# EAGLE schematic en_v5 (EAGLE 9.6.2)

## Sheet 1 of 7: Header and connector
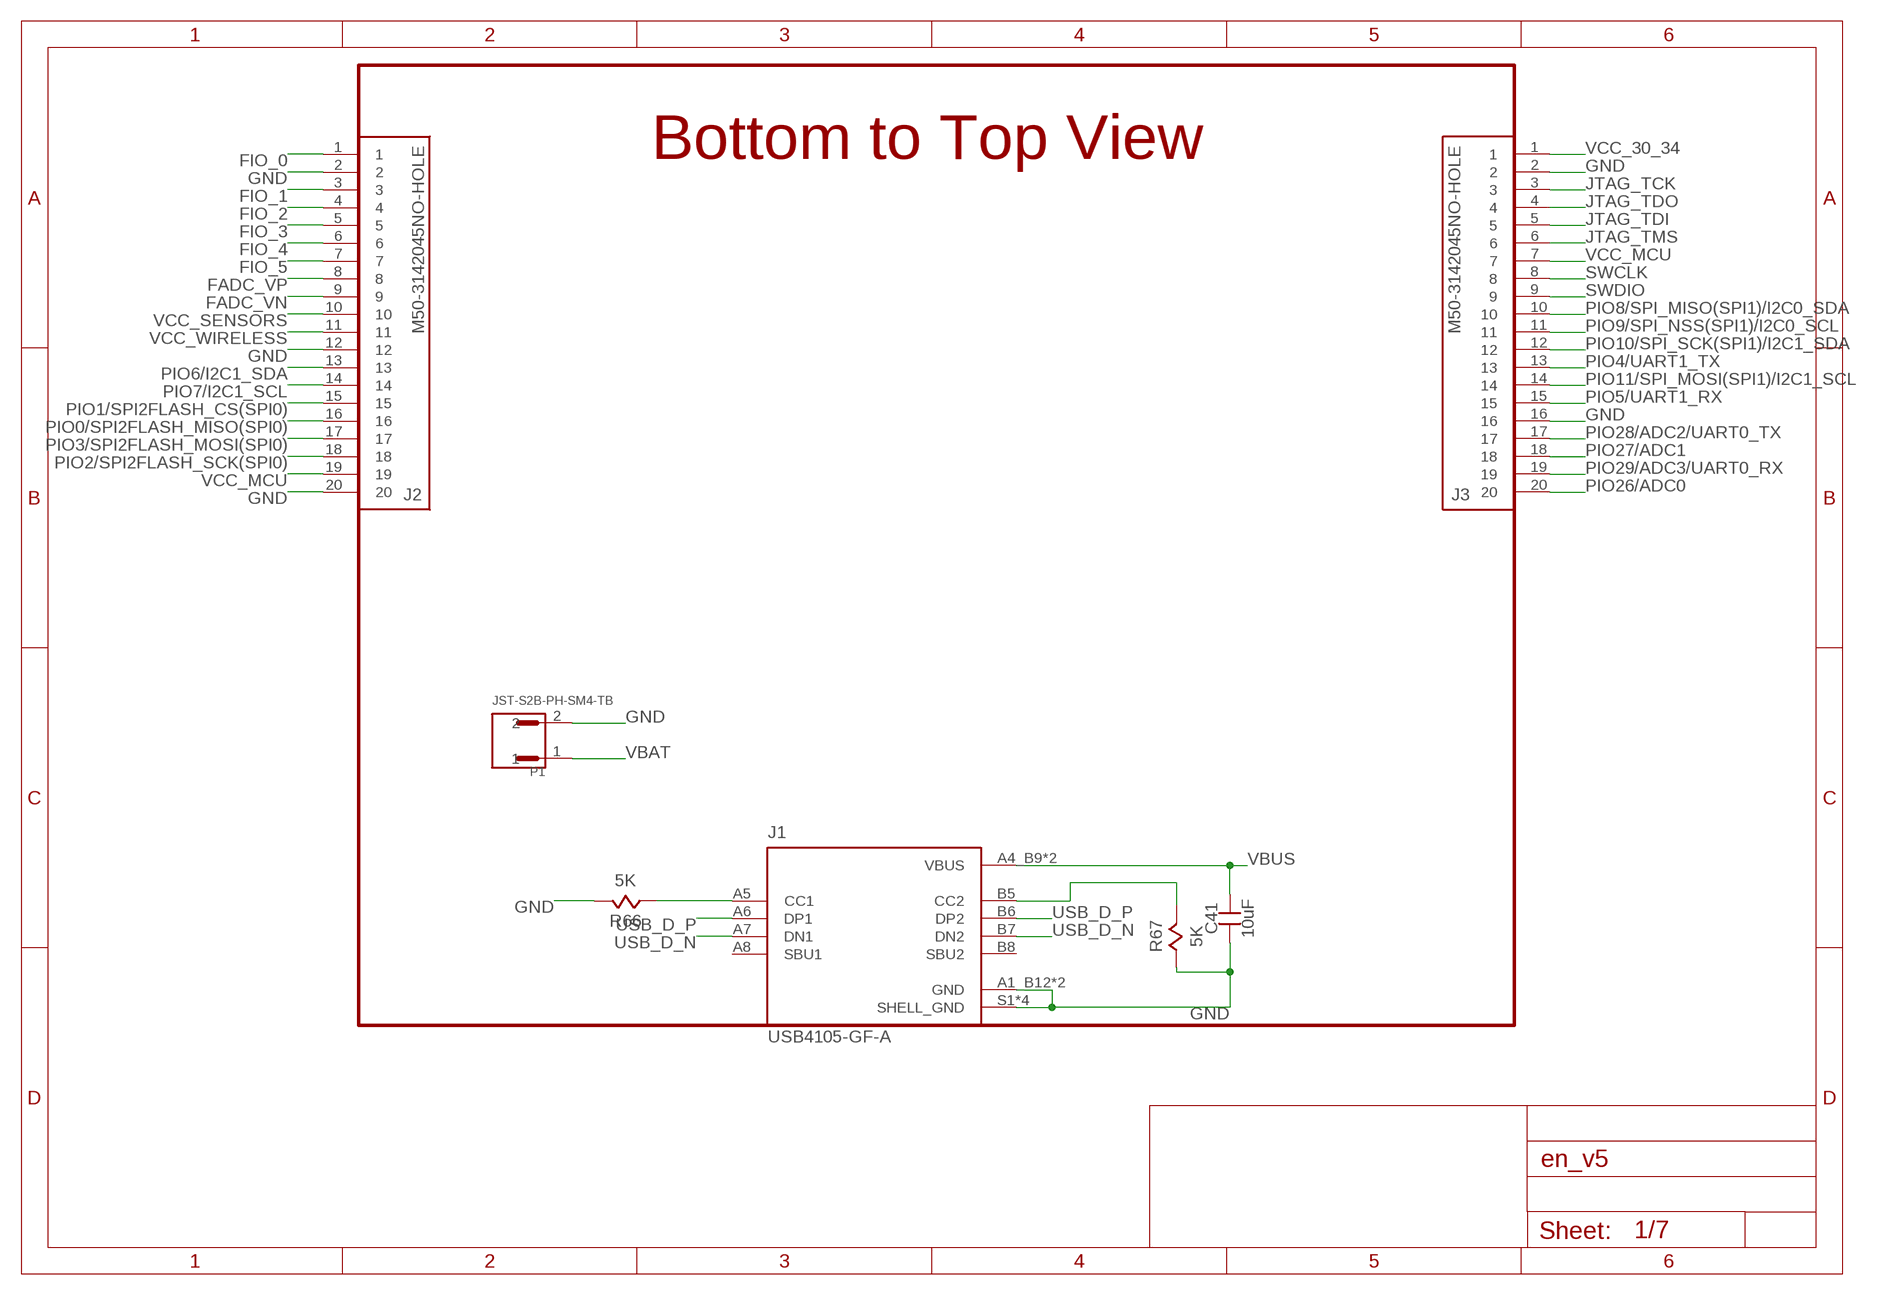
[diagram p0: schematic, sheet 1]

### Parts
C41  10uF  CAPACITOR0805  [0805]
J1  USB4105-GF-A  [GCT_USB4105-GF-A]
J2  M50-3142045NO-HOLE  [M503142045-NO_HOLE]
J3  M50-3142045NO-HOLE  [M503142045-NO_HOLE]
P1  JST-S2B-PH-SM4-TB  [JST_S2B-PH-SM4-TB]
R66  5K  RESISTORSMD_0402  [0402]
R67  5K  RESISTORSMD_0402  [0402]

### Nets
FADC_VN: J2.9 ; also sheet 5
FADC_VP: J2.8 ; also sheet 5
FIO_0: J2.1 ; also sheet 5
FIO_1: J2.3 ; also sheet 5
FIO_2: J2.4 ; also sheet 5
FIO_3: J2.5 ; also sheet 5
FIO_4: J2.6 ; also sheet 5
FIO_5: J2.7 ; also sheet 5
GND: C41.1 J1.A1_B12(GND) J1.B1_A12(GND) J1.S1(SHELL_GND) J1.S2(SHELL_GND) J1.S3(SHELL_GND) J1.S4(SHELL_GND) J2.2 J2.12 J2.20 J3.2 J3.16 P1.2 R66.2 R67.1 ; also sheet 2,3,4,5,6
JTAG_TCK: J3.3 ; also sheet 5
JTAG_TDI: J3.5 ; also sheet 5
JTAG_TDO: J3.4 ; also sheet 5
JTAG_TMS: J3.6 ; also sheet 5
N$19: J1.B5(CC2) R67.2
N$35: J1.A5(CC1) R66.1
PIO0/SPI2FLASH_MISO(SPI0): J2.16 ; also sheet 4,6
PIO1/SPI2FLASH_CS(SPI0): J2.15 ; also sheet 4,5,6
PIO2/SPI2FLASH_SCK(SPI0): J2.18 ; also sheet 4,5,6
PIO3/SPI2FLASH_MOSI(SPI0): J2.17 ; also sheet 4,6
PIO4/UART1_TX: J3.13 ; also sheet 4
PIO5/UART1_RX: J3.15 ; also sheet 4
PIO6/I2C1_SDA: J2.13 ; also sheet 3,4
PIO7/I2C1_SCL: J2.14 ; also sheet 3,4
PIO8/SPI_MISO(SPI1)/I2C0_SDA: J3.10 ; also sheet 4
PIO9/SPI_NSS(SPI1)/I2C0_SCL: J3.11
PIO10/SPI_SCK(SPI1)/I2C1_SDA: J3.12 ; also sheet 4
PIO11/SPI_MOSI(SPI1)/I2C1_SCL: J3.14
PIO26/ADC0: J3.20 ; also sheet 4
PIO27/ADC1: J3.18 ; also sheet 4
PIO28/ADC2/UART0_TX: J3.17 ; also sheet 4
PIO29/ADC3/UART0_RX: J3.19 ; also sheet 4
SWCLK: J3.8 ; also sheet 4
SWDIO: J3.9 ; also sheet 4
USB_D_N [diff pairs]: J1.A7(DN1) J1.B7(DN2) ; also sheet 4
USB_D_P [diff pairs]: J1.A6(DP1) J1.B6(DP2) ; also sheet 4
VBAT: P1.1 ; also sheet 2
VBUS: C41.2 J1.A4_B9(VBUS) J1.B4_A9(VBUS) ; also sheet 2
VCC_30_34: J3.1 ; also sheet 3,5,6
VCC_MCU: J2.19 J3.7 ; also sheet 3,4
VCC_SENSORS: J2.10 ; also sheet 3
VCC_WIRELESS: J2.11 ; also sheet 3
Unconnected: J1.A8(SBU1) J1.B8(SBU2)

### Notes on the sheet
- Bottom to Top View

## Sheet 2 of 7: Power Management
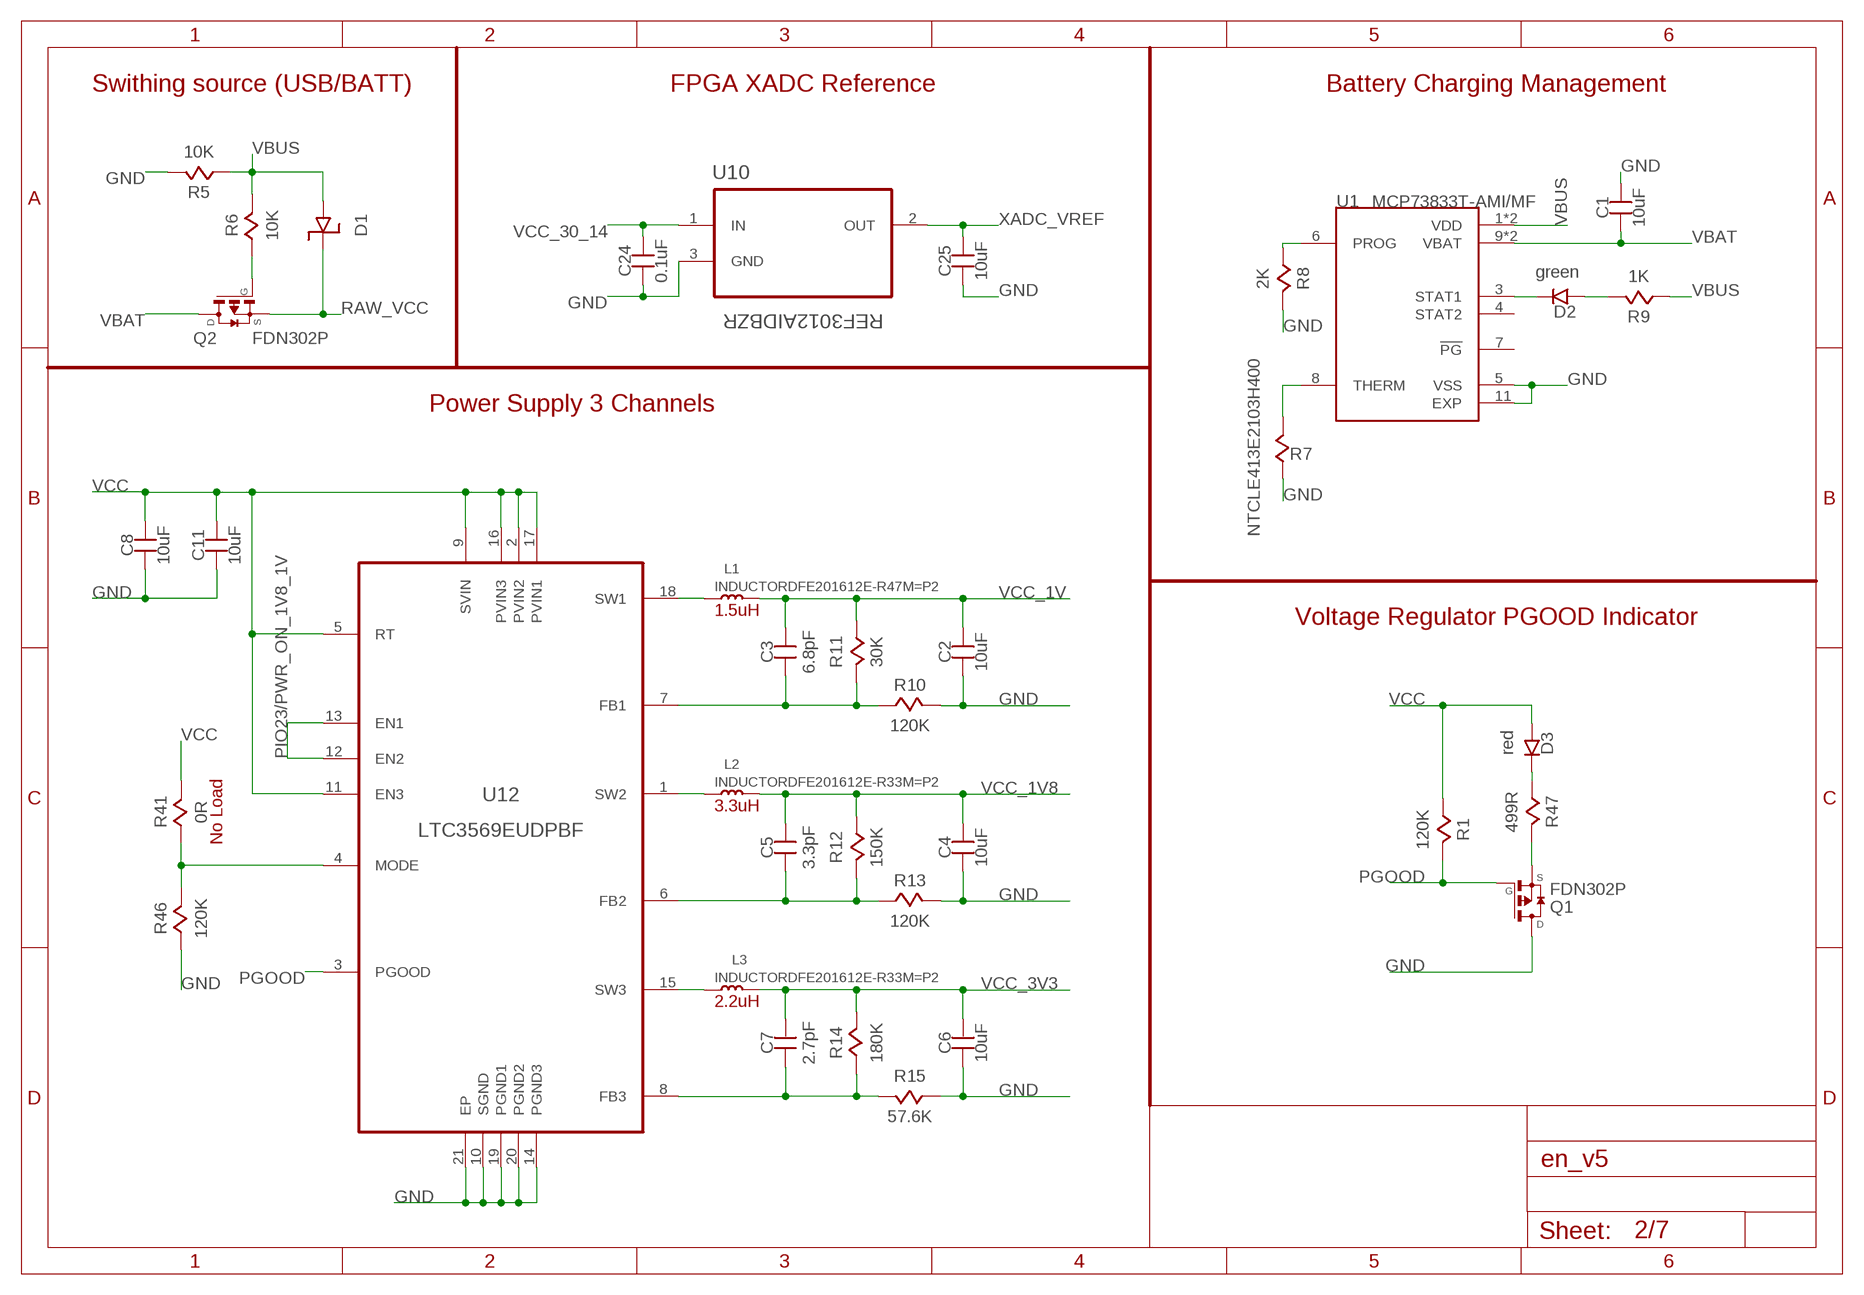
[diagram p1: schematic, sheet 2]

### Parts
C1  10uF  CAPACITOR0805  [0805]
C2  10uF  CAPACITOR0603  [CAPC1608-0603]
C3  6.8pF  CAPACITOR0402  [0402]
C4  10uF  CAPACITOR0603  [CAPC1608-0603]
C5  3.3pF  CAPACITOR0402  [0402]
C6  10uF  CAPACITOR0603  [CAPC1608-0603]
C7  2.7pF  CAPACITOR0402  [0402]
C8  10uF  CAPACITOR0603  [CAPC1608-0603]
C11  10uF  CAPACITOR0603  [CAPC1608-0603]
C24  0.1uF  CAPACITOR0402  [0402]
C25  10uF  CAPACITOR0603  [CAPC1608-0603]
D1  DIODEB5817W  SCHOTTKY_DIODEB5817W  [SOD-123]
D2  green  LED0402  [0402]
D3  red  LED0402  [0402]
L1  INDUCTORDFE201612E-R47M=P2  INDUCTORDFE201612E-R33M=P2  [INDC2016X120N]
L2  INDUCTORDFE201612E-R33M=P2  [INDC2016X120N]
L3  INDUCTORDFE201612E-R33M=P2  [INDC2016X120N]
Q1  FDN302P  [SSOT-3]
Q2  FDN302P  [SSOT-3]
R1  120K  RESISTORSMD_0402  [0402]
R5  10K  RESISTORSMD_0402  [0402]
R6  10K  RESISTORSMD_0402  [0402]
R7  NTCLE413E2103H400  RESISTORTHT_THERMAL  [THT_2]
R8  2K  RESISTORSMD_0402  [0402]
R9  1K  RESISTORSMD_0402  [0402]
R10  120K  RESISTORSMD_0402  [0402]
R11  30K  RESISTORSMD_0402  [0402]
R12  150K  RESISTORSMD_0402  [0402]
R13  120K  RESISTORSMD_0402  [0402]
R14  180K  RESISTORSMD_0402  [0402]
R15  57.6K  RESISTORSMD_0402  [0402]
R41  0R  RESISTORSMD_0402  [0402]
R46  120K  RESISTORSMD_0402  [0402]
R47  499R  RESISTORSMD_0402  [0402]
U1  MCP73833T-AMI/MF  [DFN-10(3X3X0.9)]
U10  REF3012AIDBZR  [SOT-23(3PIN)]
U12  LTC3569EUDPBF  [QFN40P300X300X80-21N]

### Nets
GND: C1.2 C2.1 C4.2 C6.2 C8.2 C11.2 C24.1 C25.1 Q1.3(D) R5.2 R7.P$1 R8.2 R10.2 R13.2 R15.2 R46.1 U1.5(VSS) U1.11(EXP) U10.3(GND) U12.10(SGND) U12.14(PGND3) U12.19(PGND1) U12.20(PGND2) U12.21(EP) ; also sheet 1,3,4,5,6
N$1: R7.P$2 U1.8(THERM)
N$2: R8.1 U1.6(PROG)
N$3: Q2.1(G) R6.1
N$4: L2.1 U12.1(SW2)
N$5: L1.1 U12.18(SW1)
N$6: D2.2 U1.3(STAT1)
N$7: D2.1 R9.2
N$8: C3.2 R10.1 R11.2 U12.7(FB1)
N$9: L3.2 U12.15(SW3)
N$11: C7.2 R14.2 R15.1 U12.8(FB3)
N$12: C5.2 R12.2 R13.1 U12.6(FB2)
N$13: Q1.2(S) R47.2
N$22: D3.2 R47.1
N$23: R41.1 R46.2 U12.4(MODE)
PGOOD: Q1.1(G) R1.2 U12.3(PGOOD)
PIO23/PWR_ON_1V8_1V: U12.12(EN2) U12.13(EN1) ; also sheet 4
RAW_VCC: D1.1(C) Q2.2(S) ; also sheet 3
VBAT: C1.1 Q2.3(D) U1.9(VBAT) U1.10(VBAT) ; also sheet 1
VBUS: D1.2(A) R5.1 R6.2 R9.1 U1.1(VDD) U1.2(VDD) ; also sheet 1
VCC: C8.1 C11.1 D3.1 R1.1 R41.2 U12.2(PVIN2) U12.5(RT) U12.9(SVIN) U12.11(EN3) U12.16(PVIN3) U12.17(PVIN1) ; also sheet 3
VCC_1V: C2.2 C3.1 L1.2 R11.1 ; also sheet 3
VCC_1V8: C4.1 C5.1 L2.2 R12.1 ; also sheet 3
VCC_3V3: C6.1 C7.1 L3.1 R14.1 ; also sheet 3
VCC_30_14: C24.2 U10.1(IN) ; also sheet 3,5,6
XADC_VREF: C25.2 U10.2(OUT) ; also sheet 5
Unconnected: U1.4(STAT2) U1.7(!PG)

### Notes on the sheet
- Swithing source (USB/BATT) | FPGA XADC Reference | Battery Charging Management
- Power Supply 3 Channels
- 1.5uH | Voltage Regulator PGOOD Indicator
- No Load | 3.3uH
- 2.2uH

## Sheet 3 of 7: Power Monitor
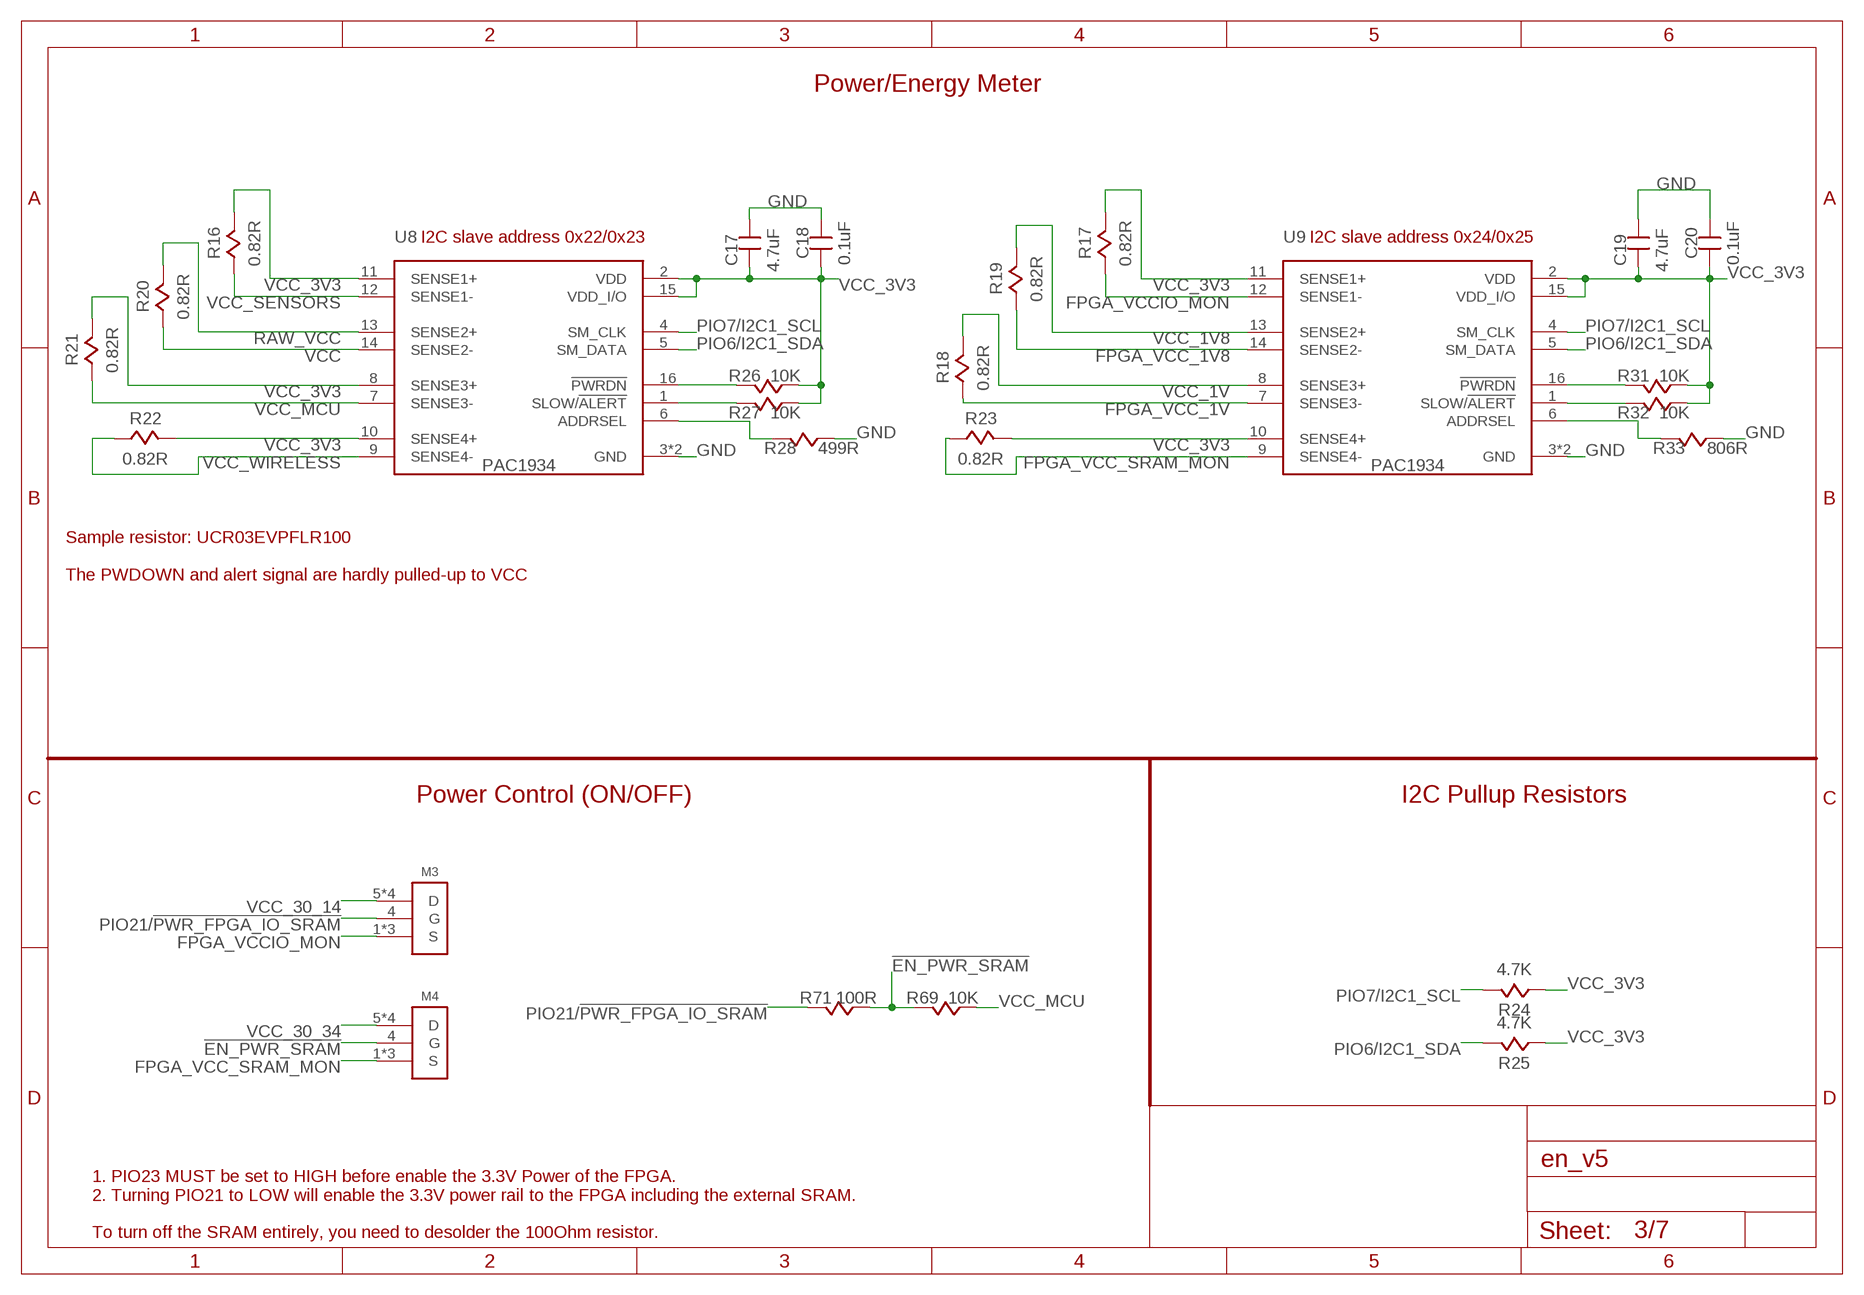
[diagram p2: schematic, sheet 3]

### Parts
C17  4.7uF  CAPACITOR0603  [CAPC1608-0603]
C18  0.1uF  CAPACITOR0402  [0402]
C19  4.7uF  CAPACITOR0603  [CAPC1608-0603]
C20  0.1uF  CAPACITOR0402  [0402]
M3  SISS23DN  [POWERPAK1212-8]
M4  SISS23DN  [POWERPAK1212-8]
R16  0.82R  RESISTOR0603  [0603]
R17  0.82R  RESISTOR0603  [0603]
R18  0.82R  RESISTOR0603  [0603]
R19  0.82R  RESISTOR0603  [0603]
R20  0.82R  RESISTOR0603  [0603]
R21  0.82R  RESISTOR0603  [0603]
R22  0.82R  RESISTOR0603  [0603]
R23  0.82R  RESISTOR0603  [0603]
R24  4.7K  RESISTORSMD_0402  [0402]
R25  4.7K  RESISTORSMD_0402  [0402]
R26  10K  RESISTORSMD_0402  [0402]
R27  10K  RESISTORSMD_0402  [0402]
R28  499R  RESISTORSMD_0402  [0402]
R31  10K  RESISTORSMD_0402  [0402]
R32  10K  RESISTORSMD_0402  [0402]
R33  806R  RESISTORSMD_0402  [0402]
R69  10K  RESISTORSMD_0402  [0402]
R71  100R  RESISTORSMD_0402  [0402]
U8  PAC1934  [UQFN-16(4×4×0.5MM)]
U9  PAC1934  [UQFN-16(4×4×0.5MM)]

### Nets
!EN_PWR_SRAM: M4.4(G) R69.2 R71.1
FPGA_VCC_1V: R18.1 U9.7(SENSE3-) ; also sheet 5,6
FPGA_VCC_1V8: R19.1 U9.14(SENSE2-) ; also sheet 5,6
FPGA_VCC_SRAM_MON: M4.1(S) M4.2(S) M4.3(S) R23.1 U9.9(SENSE4-)
FPGA_VCCIO_MON: M3.1(S) M3.2(S) M3.3(S) R17.1 U9.12(SENSE1-)
GND: C17.2 C18.2 C19.2 C20.2 R28.1 R33.1 U8.3(GND) U8.17(GND) U9.3(GND) U9.17(GND) ; also sheet 1,2,4,5,6
N$32: R26.2 U8.16(!PWRDN)
N$33: R27.2 U8.1(SLOW/!ALERT)
N$34: R28.2 U8.6(ADDRSEL)
N$48: R31.2 U9.16(!PWRDN)
N$49: R32.2 U9.1(SLOW/!ALERT)
N$50: R33.2 U9.6(ADDRSEL)
PIO6/I2C1_SDA: R25.2 U8.5(SM_DATA) U9.5(SM_DATA) ; also sheet 1,4
PIO7/I2C1_SCL: R24.2 U8.4(SM_CLK) U9.4(SM_CLK) ; also sheet 1,4
PIO21/!PWR_FPGA_IO_SRAM: M3.4(G) R71.2 ; also sheet 4
RAW_VCC: R20.2 U8.13(SENSE2+) ; also sheet 2
VCC: R20.1 U8.14(SENSE2-) ; also sheet 2
VCC_1V: R18.2 U9.8(SENSE3+) ; also sheet 2
VCC_1V8: R19.2 U9.13(SENSE2+) ; also sheet 2
VCC_3V3: C17.1 C18.1 C19.1 C20.1 R16.2 R17.2 R21.2 R22.2 R23.2 R24.1 R25.1 R26.1 R27.1 R31.1 R32.1 U8.2(VDD) U8.8(SENSE3+) U8.10(SENSE4+) U8.11(SENSE1+) U8.15(VDD_I/O) U9.2(VDD) U9.10(SENSE4+) U9.11(SENSE1+) U9.15(VDD_I/O) ; also sheet 2
VCC_30_14: M3.5(D) M3.6(D) M3.7(D) M3.8(D) ; also sheet 2,5,6
VCC_30_34: M4.5(D) M4.6(D) M4.7(D) M4.8(D) ; also sheet 1,5,6
VCC_MCU: R21.1 R69.1 U8.7(SENSE3-) ; also sheet 1,4
VCC_SENSORS: R16.1 U8.12(SENSE1-) ; also sheet 1
VCC_WIRELESS: R22.1 U8.9(SENSE4-) ; also sheet 1

### Notes on the sheet
- Power/Energy Meter
- I2C slave address 0x22/0x23 | I2C slave address 0x24/0x25
- Sample resistor: UCR03EVPFLR100
  
  The PWDOWN and alert signal are hardly pulled-up to VCC
- Power Control (ON/OFF) | I2C Pullup Resistors
- 1. PIO23 MUST be set to HIGH before enable the 3.3V Power of the FPGA.
  2. Turning PIO21 to LOW will enable the 3.3V power rail to the FPGA including the external SRAM.
  
  To turn off the SRAM entirely, you need to desolder the 100Ohm resistor.

## Sheet 4 of 7: MCU
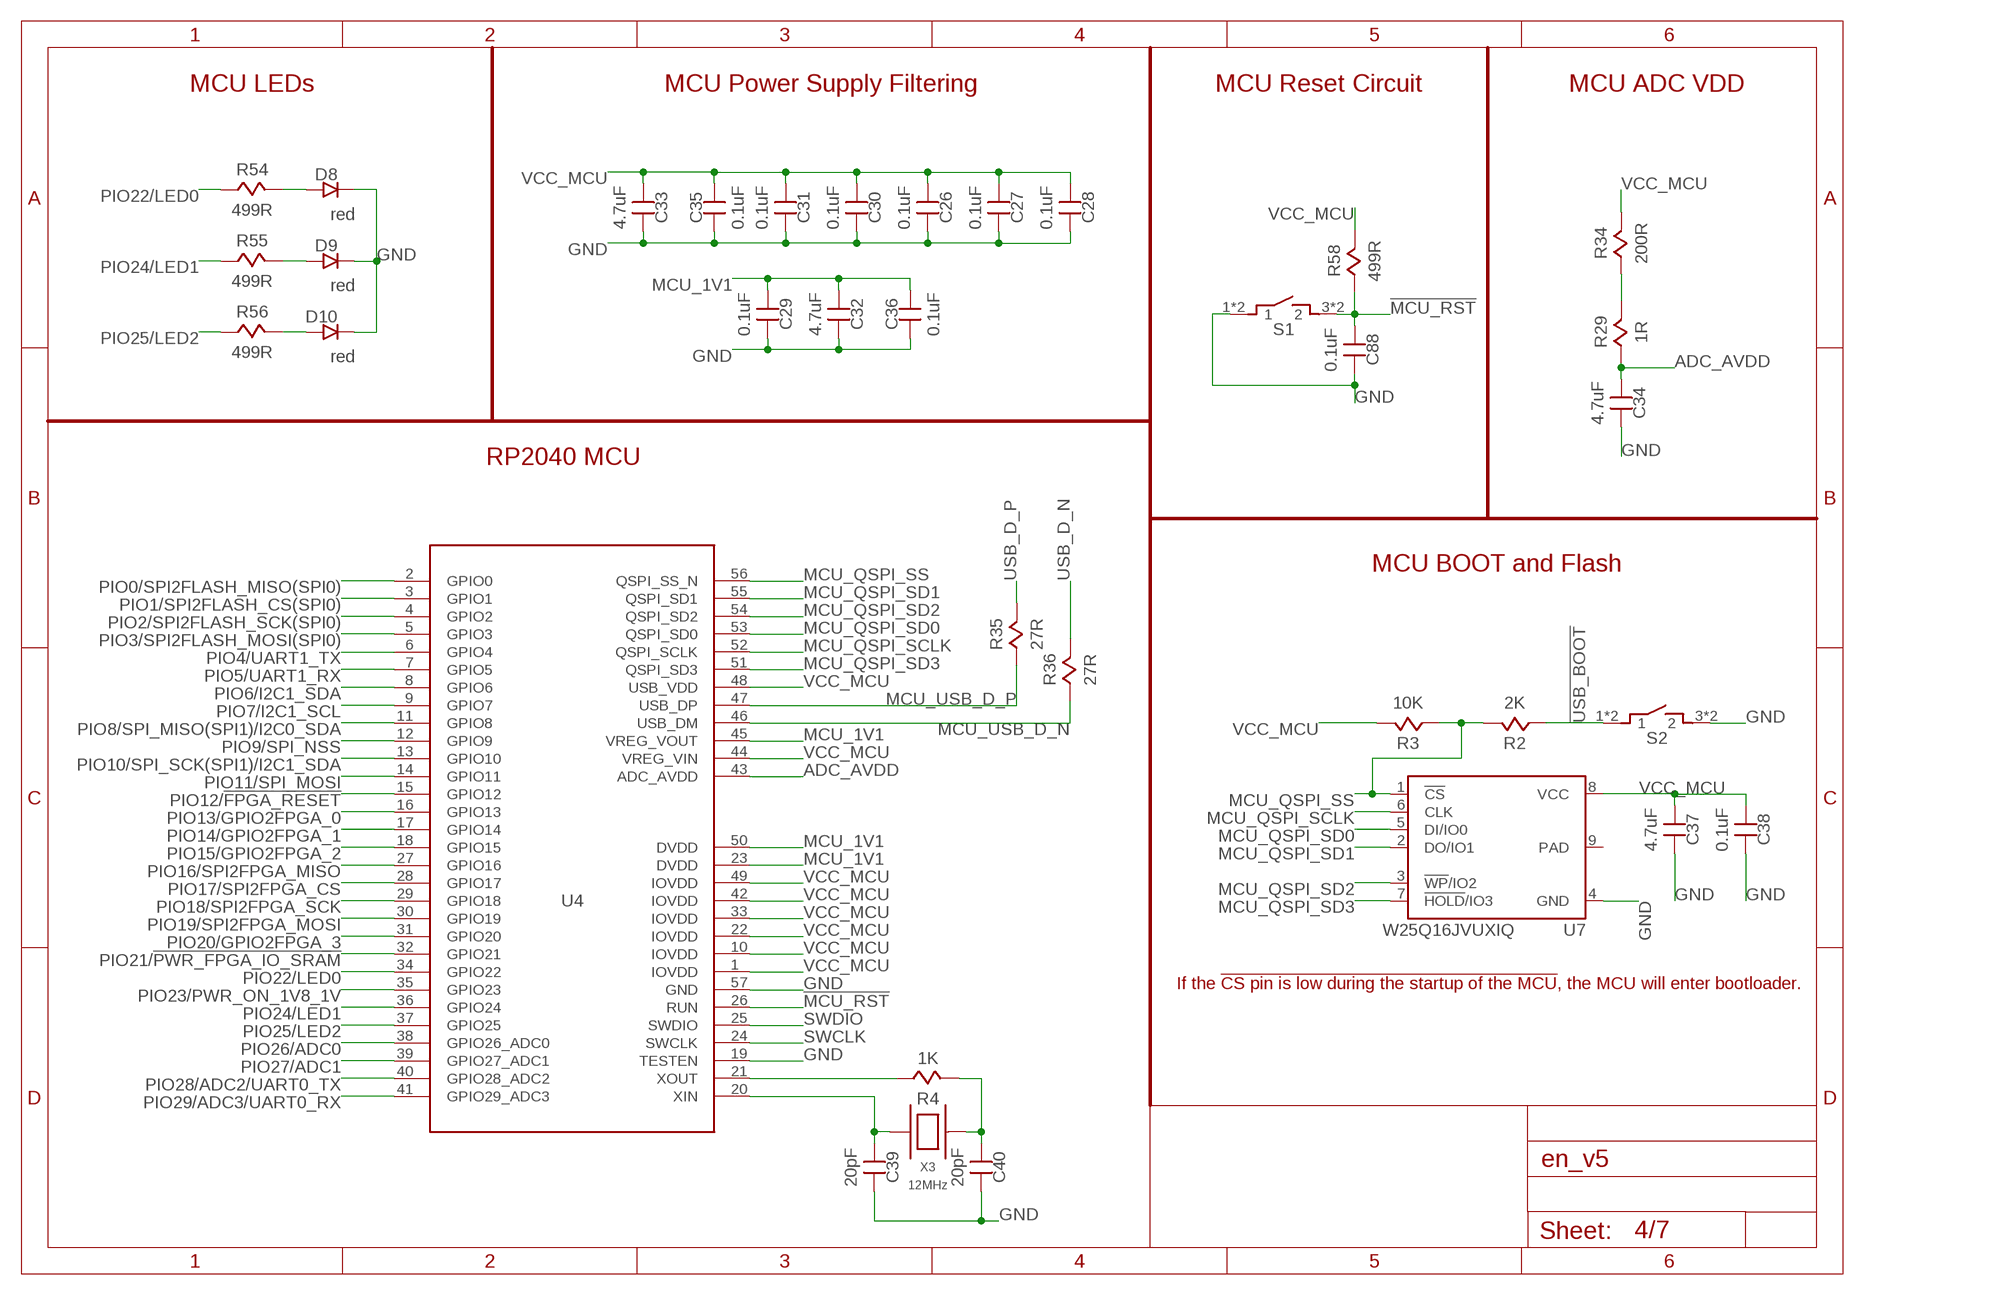
[diagram p3: schematic, sheet 4]

### Parts
C26  0.1uF  CAPACITOR0402  [0402]
C27  0.1uF  CAPACITOR0402  [0402]
C28  0.1uF  CAPACITOR0402  [0402]
C29  0.1uF  CAPACITOR0402  [0402]
C30  0.1uF  CAPACITOR0402  [0402]
C31  0.1uF  CAPACITOR0402  [0402]
C32  4.7uF  CAPACITOR0603  [CAPC1608-0603]
C33  4.7uF  CAPACITOR0603  [CAPC1608-0603]
C34  4.7uF  CAPACITOR0603  [CAPC1608-0603]
C35  0.1uF  CAPACITOR0402  [0402]
C36  0.1uF  CAPACITOR0402  [0402]
C37  4.7uF  CAPACITOR0603  [CAPC1608-0603]
C38  0.1uF  CAPACITOR0402  [0402]
C39  20pF  CAPACITOR0402  [0402]
C40  20pF  CAPACITOR0402  [0402]
C88  0.1uF  CAPACITOR0402  [0402]
D8  red  LED0402  [0402]
D9  red  LED0402  [0402]
D10  red  LED0402  [0402]
R2  2K  RESISTORSMD_0402  [0402]
R3  10K  RESISTORSMD_0402  [0402]
R4  1K  RESISTORSMD_0402  [0402]
R29  1R  RESISTORSMD_0402  [0402]
R34  200R  RESISTORSMD_0402  [0402]
R35  27R  RESISTORSMD_0402  [0402]
R36  27R  RESISTORSMD_0402  [0402]
R54  499R  RESISTORSMD_0402  [0402]
R55  499R  RESISTORSMD_0402  [0402]
R56  499R  RESISTORSMD_0402  [0402]
R58  499R  RESISTORSMD_0402  [0402]
S1  TACTILE-SWITCH  [TACTILE-SWITCH]
S2  TACTILE-SWITCH  [TACTILE-SWITCH]
U4  RP2040  [QFN40P700X700X100-57T310N]
U7  W25Q16JVUXIQ  [USON8-2X3MM]
X3  12MHz  QUARTZ  [3.2X2.5_OSC]

### Nets
!MCU_RST: C88.1 R58.1 S1.3 S1.4 U4.26(RUN)
!USB_BOOT: R2.1 S2.1 S2.2
ADC_AVDD: C34.1 R29.1 U4.43(ADC_AVDD)
ADC_VREF: R29.2 R34.1
GND: C26.2 C27.2 C28.2 C29.2 C30.2 C31.2 C32.2 C33.2 C34.2 C35.1 C36.1 C37.2 C38.2 C39.2 C40.2 C88.2 D8.2 D9.2 D10.2 S1.1 S1.2 S2.3 S2.4 U4.19(TESTEN) U4.57(GND) U7.4(GND) ; also sheet 1,2,3,5,6
MCU_1V1: C29.1 C32.1 C36.2 U4.23(DVDD) U4.45(VREG_VOUT) U4.50(DVDD)
MCU_QSPI_SCLK: U4.52(QSPI_SCLK) U7.6(CLK)
MCU_QSPI_SD0: U4.53(QSPI_SD0) U7.5(DI/IO0)
MCU_QSPI_SD1: U4.55(QSPI_SD1) U7.2(DO/IO1)
MCU_QSPI_SD2: U4.54(QSPI_SD2) U7.3(!WP!/IO2)
MCU_QSPI_SD3: U4.51(QSPI_SD3) U7.7(!HOLD!/IO3)
MCU_QSPI_SS: R2.2 R3.1 U4.56(QSPI_SS_N) U7.1(!CS)
MCU_USB_D_N: R36.1 U4.46(USB_DM)
MCU_USB_D_P: R35.1 U4.47(USB_DP)
N$15: R4.1 U4.21(XOUT)
N$17: C40.1 R4.2 X3.3
N$20: C39.1 U4.20(XIN) X3.1
N$70: D8.1 R54.2
N$71: D9.1 R55.2
N$72: D10.1 R56.2
PIO0/SPI2FLASH_MISO(SPI0): U4.2(GPIO0) ; also sheet 1,6
PIO1/SPI2FLASH_CS(SPI0): U4.3(GPIO1) ; also sheet 1,5,6
PIO2/SPI2FLASH_SCK(SPI0): U4.4(GPIO2) ; also sheet 1,5,6
PIO3/SPI2FLASH_MOSI(SPI0): U4.5(GPIO3) ; also sheet 1,6
PIO4/UART1_TX: U4.6(GPIO4) ; also sheet 1
PIO5/UART1_RX: U4.7(GPIO5) ; also sheet 1
PIO6/I2C1_SDA: U4.8(GPIO6) ; also sheet 1,3
PIO7/I2C1_SCL: U4.9(GPIO7) ; also sheet 1,3
PIO8/SPI_MISO(SPI1)/I2C0_SDA: U4.11(GPIO8) ; also sheet 1
PIO9/SPI_NSS: U4.12(GPIO9)
PIO10/SPI_SCK(SPI1)/I2C1_SDA: U4.13(GPIO10) ; also sheet 1
PIO11/SPI_MOSI: U4.14(GPIO11)
PIO12/!FPGA_RESET: U4.15(GPIO12) ; also sheet 5,6
PIO13/GPIO2FPGA_0: U4.16(GPIO13) ; also sheet 5
PIO14/GPIO2FPGA_1: U4.17(GPIO14) ; also sheet 5
PIO15/GPIO2FPGA_2: U4.18(GPIO15) ; also sheet 5
PIO16/SPI2FPGA_MISO: U4.27(GPIO16) ; also sheet 5
PIO17/SPI2FPGA_CS: U4.28(GPIO17) ; also sheet 5
PIO18/SPI2FPGA_SCK: U4.29(GPIO18) ; also sheet 5
PIO19/SPI2FPGA_MOSI: U4.30(GPIO19) ; also sheet 5
PIO20/GPIO2FPGA_3: U4.31(GPIO20) ; also sheet 5
PIO21/!PWR_FPGA_IO_SRAM: U4.32(GPIO21) ; also sheet 3
PIO22/LED0: R54.1 U4.34(GPIO22)
PIO23/PWR_ON_1V8_1V: U4.35(GPIO23) ; also sheet 2
PIO24/LED1: R55.1 U4.36(GPIO24)
PIO25/LED2: R56.1 U4.37(GPIO25)
PIO26/ADC0: U4.38(GPIO26_ADC0) ; also sheet 1
PIO27/ADC1: U4.39(GPIO27_ADC1) ; also sheet 1
PIO28/ADC2/UART0_TX: U4.40(GPIO28_ADC2) ; also sheet 1
PIO29/ADC3/UART0_RX: U4.41(GPIO29_ADC3) ; also sheet 1
SWCLK: U4.24(SWCLK) ; also sheet 1
SWDIO: U4.25(SWDIO) ; also sheet 1
USB_D_N [diff pairs]: R36.2 ; also sheet 1
USB_D_P [diff pairs]: R35.2 ; also sheet 1
VCC_MCU: C26.1 C27.1 C28.1 C30.1 C31.1 C33.1 C35.2 C37.1 C38.1 R3.2 R34.2 R58.2 U4.1(IOVDD) U4.10(IOVDD) U4.22(IOVDD) U4.33(IOVDD) U4.42(IOVDD) U4.44(VREG_VIN) U4.48(USB_VDD) U4.49(IOVDD) U7.8(VCC) ; also sheet 1,3
Unconnected: U7.9(PAD)

### Notes on the sheet
- MCU LEDs | MCU Power Supply Filtering | MCU Reset Circuit | MCU ADC VDD
- RP2040 MCU
- MCU BOOT and Flash
- If the !CS pin is low during the startup of the MCU, the MCU will enter bootloader.

## Sheet 5 of 7: FPGA Main
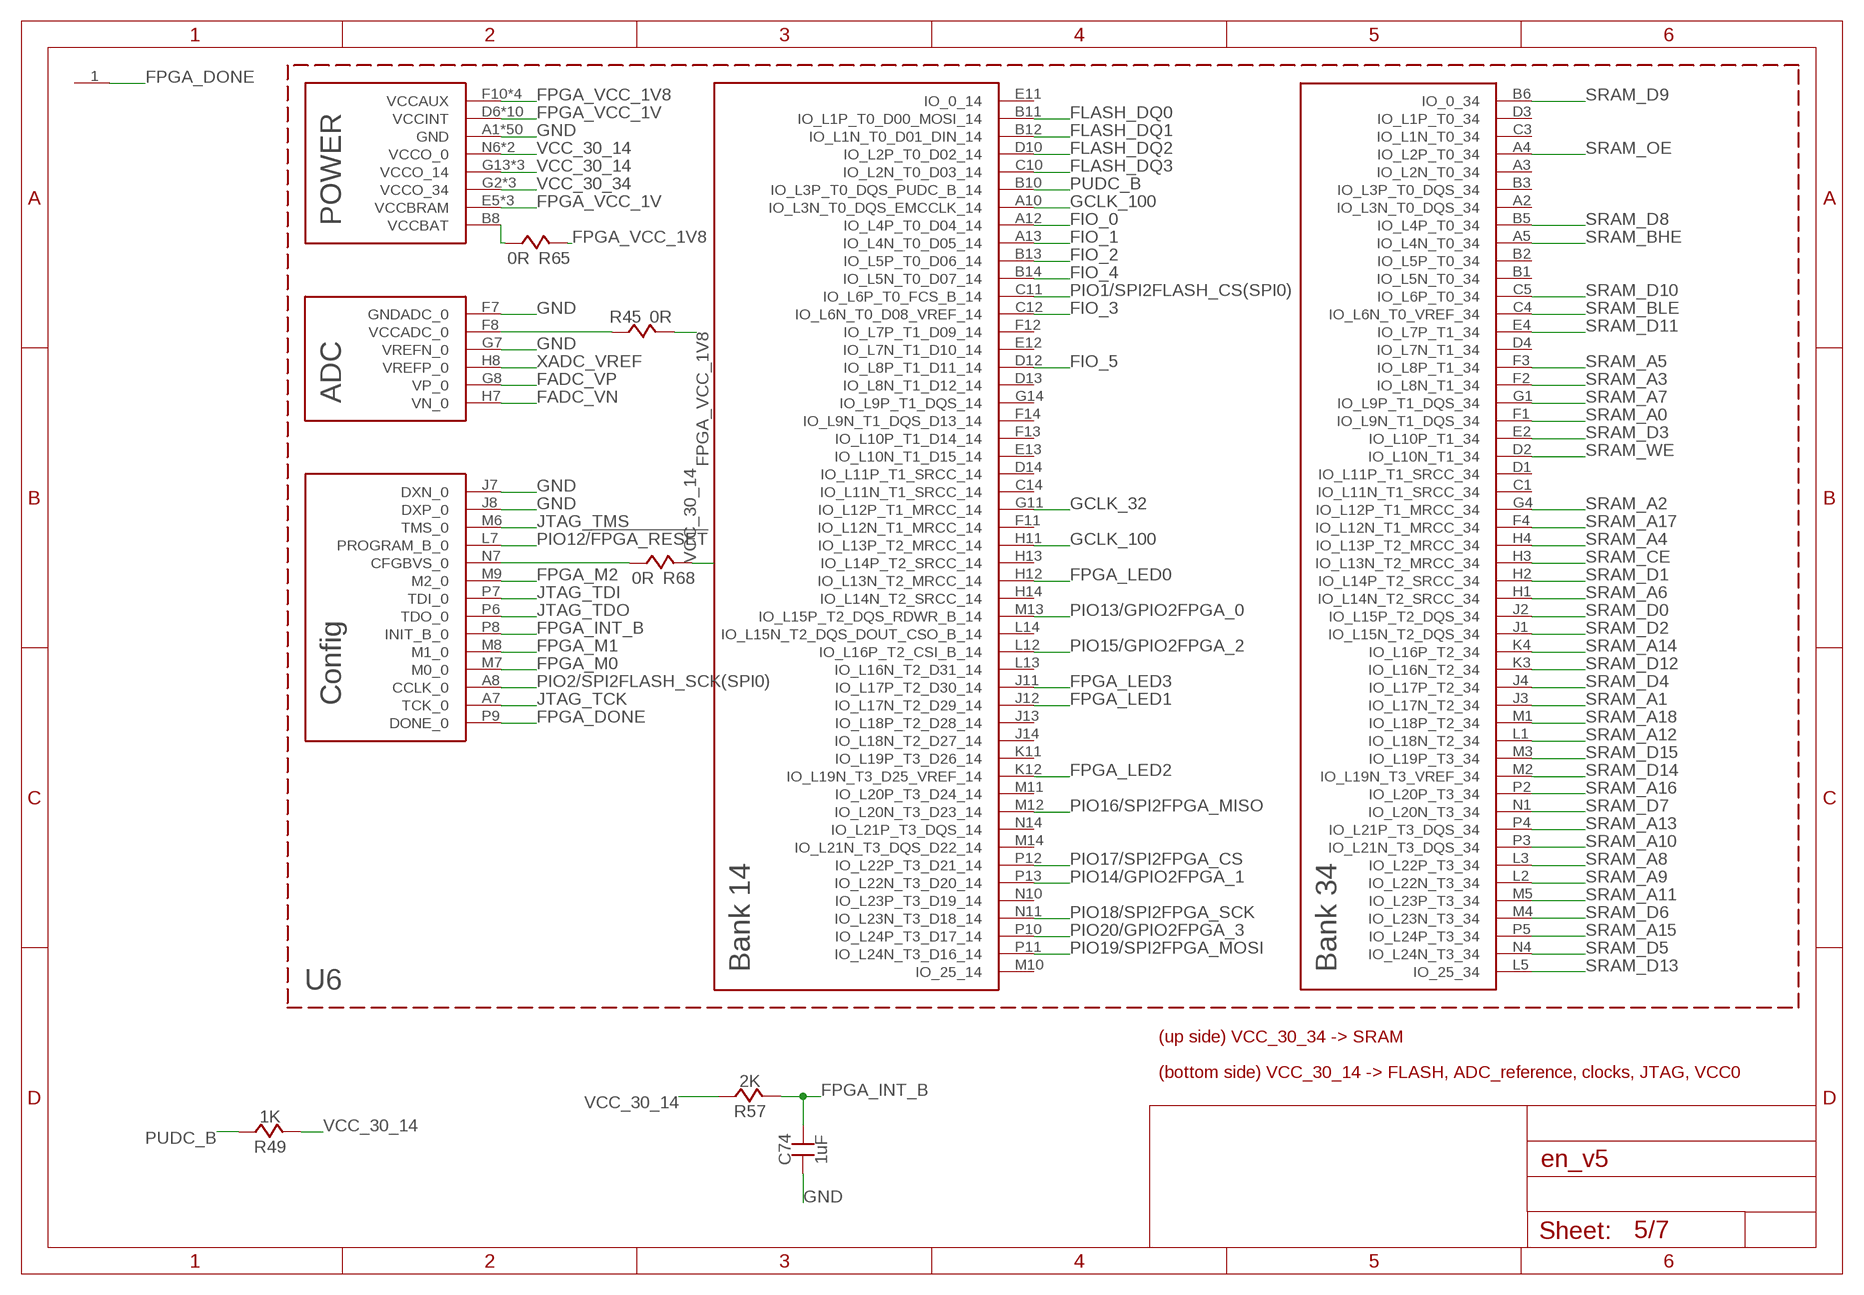
[diagram p4: schematic, sheet 5]

### Parts
C74  1uF  CAPACITOR0402  [0402]
R45  0R  RESISTORSMD_0402  [0402]
R49  1K  RESISTORSMD_0402  [0402]
R57  2K  RESISTORSMD_0402  [0402]
R65  0R  RESISTORSMD_0402  [0402]
R68  0R  RESISTORSMD_0402  [0402]
TP1  TEST_POINTSMD  [SMD_PAD]
U6  SPARTAN7-LX15  [FTGB196]

### Nets
FADC_VN: U6.H7(VN_0) ; also sheet 1
FADC_VP: U6.G8(VP_0) ; also sheet 1
FIO_0: U6.A12(IO_L4P_T0_D04_14) ; also sheet 1
FIO_1: U6.A13(IO_L4N_T0_D05_14) ; also sheet 1
FIO_2: U6.B13(IO_L5P_T0_D06_14) ; also sheet 1
FIO_3: U6.C12(IO_L6N_T0_D08_VREF_14) ; also sheet 1
FIO_4: U6.B14(IO_L5N_T0_D07_14) ; also sheet 1
FIO_5: U6.D12(IO_L8P_T1_D11_14) ; also sheet 1
FLASH_DQ0: U6.B11(IO_L1P_T0_D00_MOSI_14) ; also sheet 6
FLASH_DQ1: U6.B12(IO_L1N_T0_D01_DIN_14) ; also sheet 6
FLASH_DQ2: U6.D10(IO_L2P_T0_D02_14) ; also sheet 6
FLASH_DQ3: U6.C10(IO_L2N_T0_D03_14) ; also sheet 6
FPGA_DONE: TP1.1(>NAME) U6.P9(DONE_0)
FPGA_INT_B: C74.2 R57.2 U6.P8(INIT_B_0)
FPGA_LED0: U6.H12(IO_L13N_T2_MRCC_14) ; also sheet 6
FPGA_LED1: U6.J12(IO_L17N_T2_D29_14) ; also sheet 6
FPGA_LED2: U6.K12(IO_L19N_T3_D25_VREF_14) ; also sheet 6
FPGA_LED3: U6.J11(IO_L17P_T2_D30_14) ; also sheet 6
FPGA_M0: U6.M7(M0_0) ; also sheet 6
FPGA_M1: U6.M8(M1_0) ; also sheet 6
FPGA_M2: U6.M9(M2_0) ; also sheet 6
FPGA_VCC_1V: U6.D6(VCCINT) U6.D8(VCCINT) U6.E5(VCCBRAM) U6.E7(VCCINT) U6.E9(VCCINT) U6.F6(VCCINT) U6.G5(VCCBRAM) U6.G9(VCCINT) U6.H6(VCCINT) U6.J5(VCCBRAM) U6.J9(VCCINT) U6.K6(VCCINT) U6.K8(VCCINT) ; also sheet 3,6
FPGA_VCC_1V8: R45.2 R65.2 U6.F10(VCCAUX) U6.H10(VCCAUX) U6.K10(VCCAUX) U6.L9(VCCAUX) ; also sheet 3,6
GCLK_32: U6.G11(IO_L12P_T1_MRCC_14) ; also sheet 6
GCLK_100: U6.A10(IO_L3N_T0_DQS_EMCCLK_14) U6.H11(IO_L13P_T2_MRCC_14) ; also sheet 6
GND: C74.1 U6.A1(GND) U6.A6(GND) U6.A9(GND) U6.A11(GND) U6.A14(GND) U6.B4(GND) U6.B7(GND) U6.B9(GND) U6.C2(GND) U6.C6(GND) U6.C7(GND) U6.C8(GND) U6.C9(GND) U6.C13(GND) U6.D5(GND) U6.D7(GND) U6.D9(GND) U6.D11(GND) U6.E1(GND) U6.E3(GND) U6.E6(GND) U6.E8(GND) U6.E10(GND) U6.E14(GND) U6.F5(GND) U6.F7(GNDADC_0) U6.F9(GND) U6.G3(GND) U6.G6(GND) U6.G7(VREFN_0) U6.G10(GND) U6.G12(GND) U6.H5(GND) U6.H9(GND) U6.J6(GND) U6.J7(DXN_0) U6.J8(DXP_0) U6.J10(GND) U6.K1(GND) U6.K5(GND) U6.K7(GND) U6.K9(GND) U6.K14(GND) U6.L4(GND) U6.L6(GND) U6.L8(GND) U6.L10(GND) U6.L11(GND) U6.N3(GND) U6.N5(GND) U6.N9(GND) U6.N12(GND) U6.P1(GND) U6.P14(GND) ; also sheet 1,2,3,4,6
JTAG_TCK: U6.A7(TCK_0) ; also sheet 1
JTAG_TDI: U6.P7(TDI_0) ; also sheet 1
JTAG_TDO: U6.P6(TDO_0) ; also sheet 1
JTAG_TMS: U6.M6(TMS_0) ; also sheet 1
N$10: R65.1 U6.B8(VCCBAT)
N$14: R68.1 U6.N7(CFGBVS_0)
N$16: R45.1 U6.F8(VCCADC_0)
PIO1/SPI2FLASH_CS(SPI0): U6.C11(IO_L6P_T0_FCS_B_14) ; also sheet 1,4,6
PIO2/SPI2FLASH_SCK(SPI0): U6.A8(CCLK_0) ; also sheet 1,4,6
PIO12/!FPGA_RESET: U6.L7(PROGRAM_B_0) ; also sheet 4,6
PIO13/GPIO2FPGA_0: U6.M13(IO_L15P_T2_DQS_RDWR_B_14) ; also sheet 4
PIO14/GPIO2FPGA_1: U6.P13(IO_L22N_T3_D20_14) ; also sheet 4
PIO15/GPIO2FPGA_2: U6.L12(IO_L16P_T2_CSI_B_14) ; also sheet 4
PIO16/SPI2FPGA_MISO: U6.M12(IO_L20N_T3_D23_14) ; also sheet 4
PIO17/SPI2FPGA_CS: U6.P12(IO_L22P_T3_D21_14) ; also sheet 4
PIO18/SPI2FPGA_SCK: U6.N11(IO_L23N_T3_D18_14) ; also sheet 4
PIO19/SPI2FPGA_MOSI: U6.P11(IO_L24N_T3_D16_14) ; also sheet 4
PIO20/GPIO2FPGA_3: U6.P10(IO_L24P_T3_D17_14) ; also sheet 4
PUDC_B: R49.1 U6.B10(IO_L3P_T0_DQS_PUDC_B_14)
SRAM_A0: U6.F1(IO_L9N_T1_DQS_34) ; also sheet 6
SRAM_A1: U6.J3(IO_L17N_T2_34) ; also sheet 6
SRAM_A2: U6.G4(IO_L12P_T1_MRCC_34) ; also sheet 6
SRAM_A3: U6.F2(IO_L8N_T1_34) ; also sheet 6
SRAM_A4: U6.H4(IO_L13P_T2_MRCC_34) ; also sheet 6
SRAM_A5: U6.F3(IO_L8P_T1_34) ; also sheet 6
SRAM_A6: U6.H1(IO_L14N_T2_SRCC_34) ; also sheet 6
SRAM_A7: U6.G1(IO_L9P_T1_DQS_34) ; also sheet 6
SRAM_A8: U6.L3(IO_L22P_T3_34) ; also sheet 6
SRAM_A9: U6.L2(IO_L22N_T3_34) ; also sheet 6
SRAM_A10: U6.P3(IO_L21N_T3_DQS_34) ; also sheet 6
SRAM_A11: U6.M5(IO_L23P_T3_34) ; also sheet 6
SRAM_A12: U6.L1(IO_L18N_T2_34) ; also sheet 6
SRAM_A13: U6.P4(IO_L21P_T3_DQS_34) ; also sheet 6
SRAM_A14: U6.K4(IO_L16P_T2_34) ; also sheet 6
SRAM_A15: U6.P5(IO_L24P_T3_34) ; also sheet 6
SRAM_A16: U6.P2(IO_L20P_T3_34) ; also sheet 6
SRAM_A17: U6.F4(IO_L12N_T1_MRCC_34) ; also sheet 6
SRAM_A18: U6.M1(IO_L18P_T2_34) ; also sheet 6
SRAM_BHE: U6.A5(IO_L4N_T0_34) ; also sheet 6
SRAM_BLE: U6.C4(IO_L6N_T0_VREF_34) ; also sheet 6
SRAM_CE: U6.H3(IO_L13N_T2_MRCC_34) ; also sheet 6
SRAM_D0: U6.J2(IO_L15P_T2_DQS_34) ; also sheet 6
SRAM_D1: U6.H2(IO_L14P_T2_SRCC_34) ; also sheet 6
SRAM_D2: U6.J1(IO_L15N_T2_DQS_34) ; also sheet 6
SRAM_D3: U6.E2(IO_L10P_T1_34) ; also sheet 6
SRAM_D4: U6.J4(IO_L17P_T2_34) ; also sheet 6
SRAM_D5: U6.N4(IO_L24N_T3_34) ; also sheet 6
SRAM_D6: U6.M4(IO_L23N_T3_34) ; also sheet 6
SRAM_D7: U6.N1(IO_L20N_T3_34) ; also sheet 6
SRAM_D8: U6.B5(IO_L4P_T0_34) ; also sheet 6
SRAM_D9: U6.B6(IO_0_34) ; also sheet 6
SRAM_D10: U6.C5(IO_L6P_T0_34) ; also sheet 6
SRAM_D11: U6.E4(IO_L7P_T1_34) ; also sheet 6
SRAM_D12: U6.K3(IO_L16N_T2_34) ; also sheet 6
SRAM_D13: U6.L5(IO_25_34) ; also sheet 6
SRAM_D14: U6.M2(IO_L19N_T3_VREF_34) ; also sheet 6
SRAM_D15: U6.M3(IO_L19P_T3_34) ; also sheet 6
SRAM_OE: U6.A4(IO_L2P_T0_34) ; also sheet 6
SRAM_WE: U6.D2(IO_L10N_T1_34) ; also sheet 6
VCC_30_14: R49.2 R57.1 R68.2 U6.G13(VCCO_14) U6.K13(VCCO_14) U6.N6(VCCO_0) U6.N8(VCCO_0) U6.N13(VCCO_14) ; also sheet 2,3,6
VCC_30_34: U6.G2(VCCO_34) U6.K2(VCCO_34) U6.N2(VCCO_34) ; also sheet 1,3,6
XADC_VREF: U6.H8(VREFP_0) ; also sheet 2
Unconnected: U6.A2(IO_L3N_T0_DQS_34) U6.A3(IO_L2N_T0_34) U6.B1(IO_L5N_T0_34) U6.B2(IO_L5P_T0_34) U6.B3(IO_L3P_T0_DQS_34) U6.C1(IO_L11N_T1_SRCC_34) U6.C3(IO_L1N_T0_34) U6.C14(IO_L11N_T1_SRCC_14) U6.D1(IO_L11P_T1_SRCC_34) U6.D3(IO_L1P_T0_34) U6.D4(IO_L7N_T1_34) U6.D13(IO_L8N_T1_D12_14) U6.D14(IO_L11P_T1_SRCC_14) U6.E11(IO_0_14) U6.E12(IO_L7N_T1_D10_14) U6.E13(IO_L10N_T1_D15_14) U6.F11(IO_L12N_T1_MRCC_14) U6.F12(IO_L7P_T1_D09_14) U6.F13(IO_L10P_T1_D14_14) U6.F14(IO_L9N_T1_DQS_D13_14) U6.G14(IO_L9P_T1_DQS_14) U6.H13(IO_L14P_T2_SRCC_14) U6.H14(IO_L14N_T2_SRCC_14) U6.J13(IO_L18P_T2_D28_14) U6.J14(IO_L18N_T2_D27_14) U6.K11(IO_L19P_T3_D26_14) U6.L13(IO_L16N_T2_D31_14) U6.L14(IO_L15N_T2_DQS_DOUT_CSO_B_14) U6.M10(IO_25_14) U6.M11(IO_L20P_T3_D24_14) U6.M14(IO_L21N_T3_DQS_D22_14) U6.N10(IO_L23P_T3_D19_14) U6.N14(IO_L21P_T3_DQS_14)

### Notes on the sheet
- (up side) VCC_30_34 -> SRAM
- (bottom side) VCC_30_14 -> FLASH, ADC_reference, clocks, JTAG, VCC0

## Sheet 6 of 7: FPGA Accessory
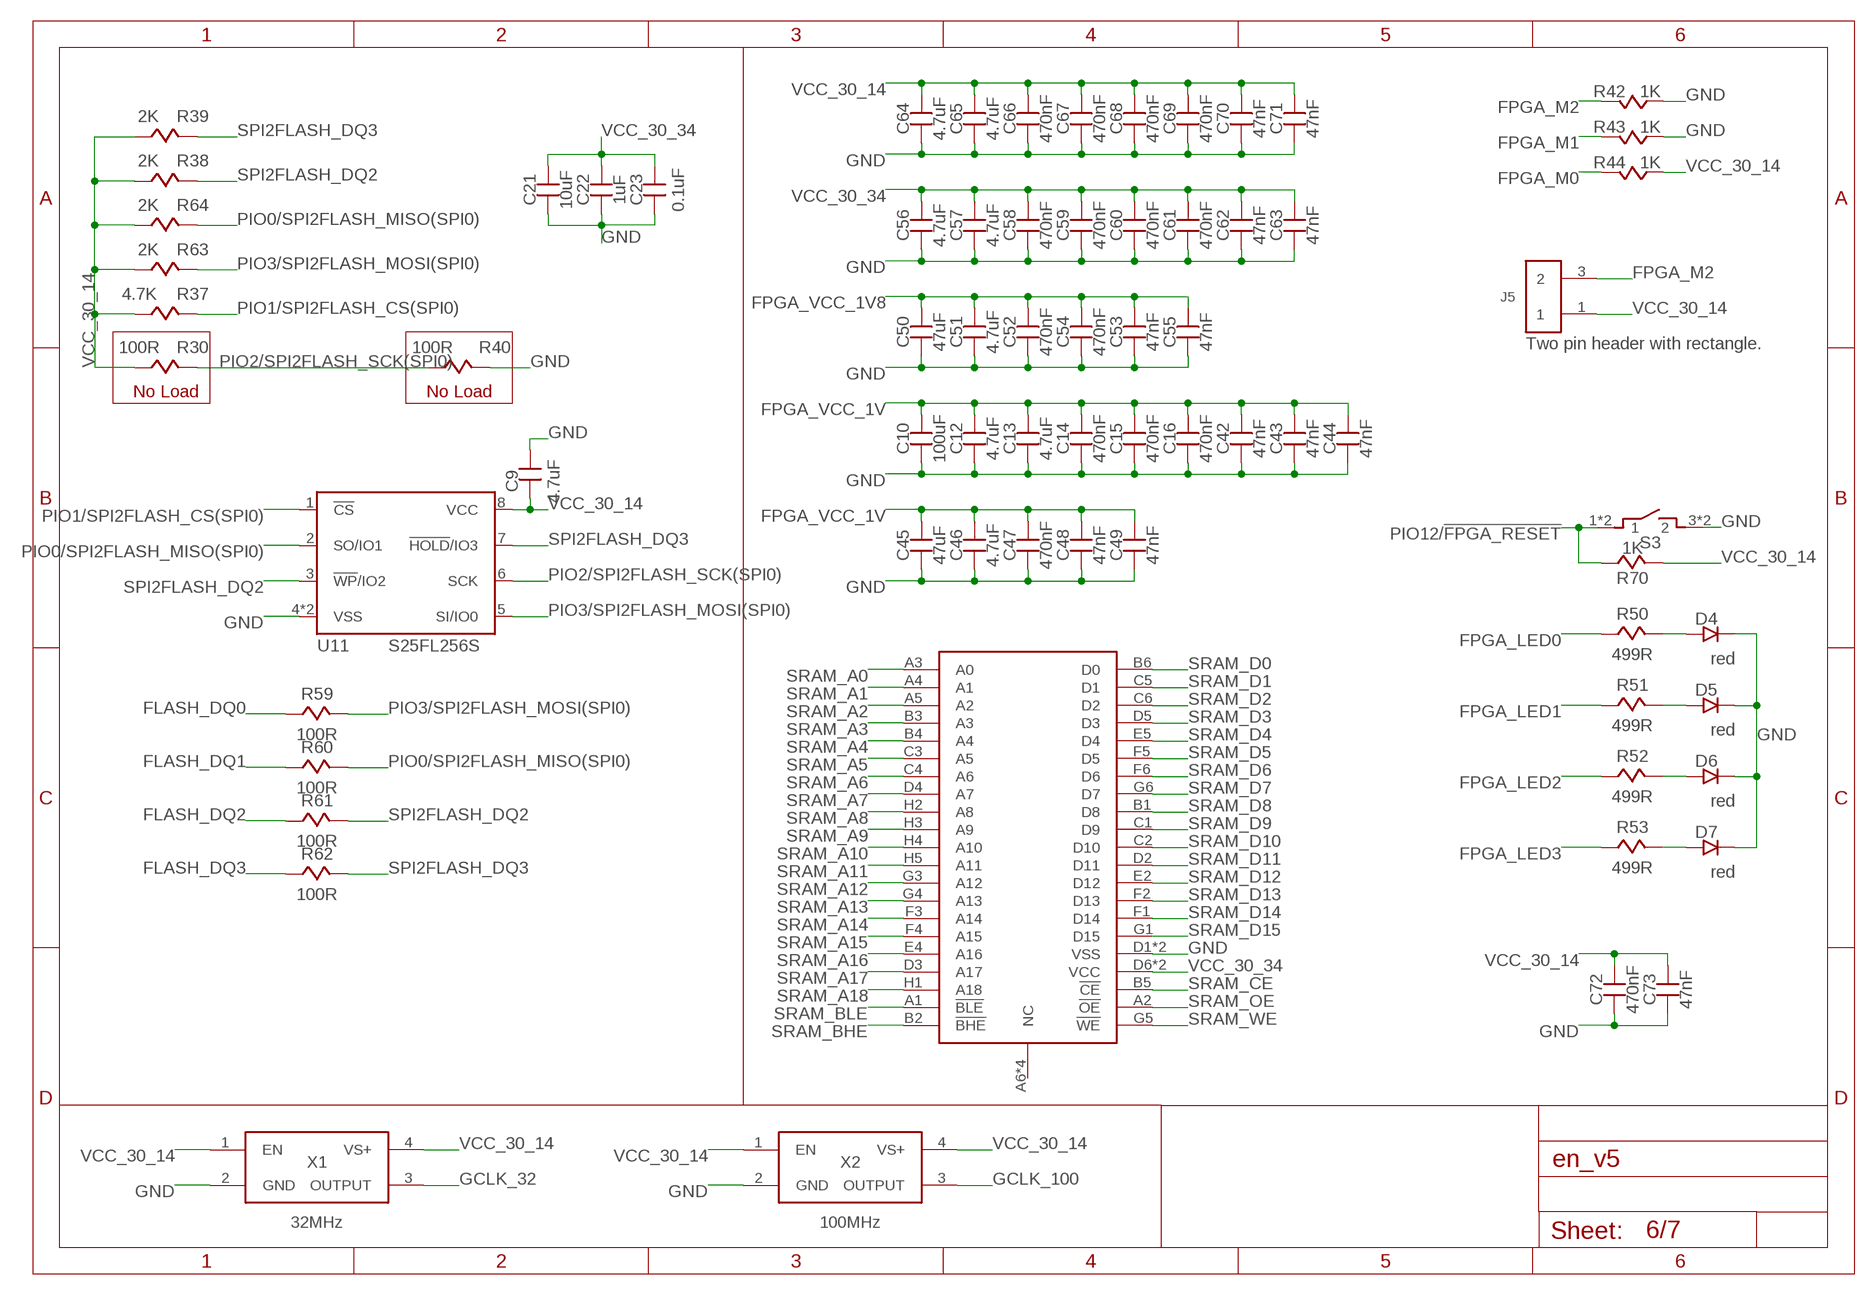
[diagram p5: schematic, sheet 6]

### Parts
C9  4.7uF  CAPACITOR0603  [CAPC1608-0603]
C10  100uF  CAPACITOR0805  [0805]
C12  4.7uF  CAPACITOR0603  [CAPC1608-0603]
C13  4.7uF  CAPACITOR0603  [CAPC1608-0603]
C14  470nF  CAPACITOR0402  [0402]
C15  470nF  CAPACITOR0402  [0402]
C16  470nF  CAPACITOR0402  [0402]
C21  10uF  CAPACITOR0603  [CAPC1608-0603]
C22  1uF  CAPACITOR0402  [0402]
C23  0.1uF  CAPACITOR0402  [0402]
C42  47nF  CAPACITOR0402  [0402]
C43  47nF  CAPACITOR0402  [0402]
C44  47nF  CAPACITOR0402  [0402]
C45  47uF  CAPACITOR0805  [0805]
C46  4.7uF  CAPACITOR0603  [CAPC1608-0603]
C47  470nF  CAPACITOR0402  [0402]
C48  47nF  CAPACITOR0402  [0402]
C49  47nF  CAPACITOR0402  [0402]
C50  47uF  CAPACITOR0805  [0805]
C51  4.7uF  CAPACITOR0603  [CAPC1608-0603]
C52  470nF  CAPACITOR0402  [0402]
C53  47nF  CAPACITOR0402  [0402]
C54  470nF  CAPACITOR0402  [0402]
C55  47nF  CAPACITOR0402  [0402]
C56  4.7uF  CAPACITOR0603  [CAPC1608-0603]
C57  4.7uF  CAPACITOR0603  [CAPC1608-0603]
C58  470nF  CAPACITOR0402  [0402]
C59  470nF  CAPACITOR0402  [0402]
C60  470nF  CAPACITOR0402  [0402]
C61  470nF  CAPACITOR0402  [0402]
C62  47nF  CAPACITOR0402  [0402]
C63  47nF  CAPACITOR0402  [0402]
C64  4.7uF  CAPACITOR0603  [CAPC1608-0603]
C65  4.7uF  CAPACITOR0603  [CAPC1608-0603]
C66  470nF  CAPACITOR0402  [0402]
C67  470nF  CAPACITOR0402  [0402]
C68  470nF  CAPACITOR0402  [0402]
C69  470nF  CAPACITOR0402  [0402]
C70  47nF  CAPACITOR0402  [0402]
C71  47nF  CAPACITOR0402  [0402]
C72  470nF  CAPACITOR0402  [0402]
C73  47nF  CAPACITOR0402  [0402]
D4  red  LED0402  [0402]
D5  red  LED0402  [0402]
D6  red  LED0402  [0402]
D7  red  LED0402  [0402]
J5  FEMALE_HEADER_2X1  [2X1_HEADER]
R30  100R  RESISTORSMD_0402  [0402]
R37  4.7K  RESISTORSMD_0402  [0402]
R38  2K  RESISTORSMD_0402  [0402]
R39  2K  RESISTORSMD_0402  [0402]
R40  100R  RESISTORSMD_0402  [0402]
R42  1K  RESISTORSMD_0402  [0402]
R43  1K  RESISTORSMD_0402  [0402]
R44  1K  RESISTORSMD_0402  [0402]
R50  499R  RESISTORSMD_0402  [0402]
R51  499R  RESISTORSMD_0402  [0402]
R52  499R  RESISTORSMD_0402  [0402]
R53  499R  RESISTORSMD_0402  [0402]
R59  100R  RESISTORSMD_0402  [0402]
R60  100R  RESISTORSMD_0402  [0402]
R61  100R  RESISTORSMD_0402  [0402]
R62  100R  RESISTORSMD_0402  [0402]
R63  2K  RESISTORSMD_0402  [0402]
R64  2K  RESISTORSMD_0402  [0402]
R70  1K  RESISTORSMD_0402  [0402]
S3  TACTILE-SWITCH  [TACTILE-SWITCH]
U5  CY7C1051DV33  [BGA-48]
U11  S25FL256S  [WSON6X8MM]
X1  32MHz  OSCILLATOR3.2X2.5  [3.2X2.5_OSC]
X2  100MHz  OSCILLATOR3.2X2.5  [3.2X2.5_OSC]

### Nets
FLASH_DQ0: R59.1 ; also sheet 5
FLASH_DQ1: R60.1 ; also sheet 5
FLASH_DQ2: R61.1 ; also sheet 5
FLASH_DQ3: R62.1 ; also sheet 5
FPGA_LED0: R50.1 ; also sheet 5
FPGA_LED1: R51.1 ; also sheet 5
FPGA_LED2: R52.1 ; also sheet 5
FPGA_LED3: R53.1 ; also sheet 5
FPGA_M0: R44.2 ; also sheet 5
FPGA_M1: R43.2 ; also sheet 5
FPGA_M2: J5.3 R42.2 ; also sheet 5
FPGA_VCC_1V: C10.2 C12.2 C13.2 C14.2 C15.2 C16.2 C42.2 C43.2 C44.2 C45.2 C46.2 C47.2 C48.2 C49.2 ; also sheet 3,5
FPGA_VCC_1V8: C50.2 C51.2 C52.2 C53.2 C54.2 C55.2 ; also sheet 3,5
GCLK_32: X1.3(OUTPUT) ; also sheet 5
GCLK_100: X2.3(OUTPUT) ; also sheet 5
GND: C9.2 C10.1 C12.1 C13.1 C14.1 C15.1 C16.1 C21.1 C22.1 C23.1 C42.1 C43.1 C44.1 C45.1 C46.1 C47.1 C48.1 C49.1 C50.1 C51.1 C52.1 C53.1 C54.1 C55.1 C56.1 C57.1 C58.1 C59.1 C60.1 C61.1 C62.1 C63.1 C64.1 C65.1 C66.1 C67.1 C68.1 C69.1 C70.1 C71.1 C72.1 C73.1 D4.2 D5.2 D6.2 D7.2 R40.2 R42.1 R43.1 S3.3 S3.4 U5.D1(VSS) U5.E6(VSS) U11.4(VSS) U11.9(VSS) X1.2(GND) X2.2(GND) ; also sheet 1,2,3,4,5
N$31: D4.1 R50.2
N$42: D5.1 R51.2
N$61: D6.1 R52.2
N$62: D7.1 R53.2
PIO0/SPI2FLASH_MISO(SPI0): R60.2 R64.2 U11.2(SO/IO1) ; also sheet 1,4
PIO1/SPI2FLASH_CS(SPI0): R37.2 U11.1(!CS) ; also sheet 1,4,5
PIO2/SPI2FLASH_SCK(SPI0): R30.2 R40.1 U11.6(SCK) ; also sheet 1,4,5
PIO3/SPI2FLASH_MOSI(SPI0): R59.2 R63.2 U11.5(SI/IO0) ; also sheet 1,4
PIO12/!FPGA_RESET: R70.1 S3.1 S3.2 ; also sheet 4,5
SPI2FLASH_DQ2: R38.2 R61.2 U11.3(!WP!/IO2)
SPI2FLASH_DQ3: R39.2 R62.2 U11.7(!HOLD!/IO3)
SRAM_A0: U5.A3(A0) ; also sheet 5
SRAM_A1: U5.A4(A1) ; also sheet 5
SRAM_A2: U5.A5(A2) ; also sheet 5
SRAM_A3: U5.B3(A3) ; also sheet 5
SRAM_A4: U5.B4(A4) ; also sheet 5
SRAM_A5: U5.C3(A5) ; also sheet 5
SRAM_A6: U5.C4(A6) ; also sheet 5
SRAM_A7: U5.D4(A7) ; also sheet 5
SRAM_A8: U5.H2(A8) ; also sheet 5
SRAM_A9: U5.H3(A9) ; also sheet 5
SRAM_A10: U5.H4(A10) ; also sheet 5
SRAM_A11: U5.H5(A11) ; also sheet 5
SRAM_A12: U5.G3(A12) ; also sheet 5
SRAM_A13: U5.G4(A13) ; also sheet 5
SRAM_A14: U5.F3(A14) ; also sheet 5
SRAM_A15: U5.F4(A15) ; also sheet 5
SRAM_A16: U5.E4(A16) ; also sheet 5
SRAM_A17: U5.D3(A17) ; also sheet 5
SRAM_A18: U5.H1(A18) ; also sheet 5
SRAM_BHE: U5.B2(!BHE) ; also sheet 5
SRAM_BLE: U5.A1(!BLE) ; also sheet 5
SRAM_CE: U5.B5(!CE) ; also sheet 5
SRAM_D0: U5.B6(D0) ; also sheet 5
SRAM_D1: U5.C5(D1) ; also sheet 5
SRAM_D2: U5.C6(D2) ; also sheet 5
SRAM_D3: U5.D5(D3) ; also sheet 5
SRAM_D4: U5.E5(D4) ; also sheet 5
SRAM_D5: U5.F5(D5) ; also sheet 5
SRAM_D6: U5.F6(D6) ; also sheet 5
SRAM_D7: U5.G6(D7) ; also sheet 5
SRAM_D8: U5.B1(D8) ; also sheet 5
SRAM_D9: U5.C1(D9) ; also sheet 5
SRAM_D10: U5.C2(D10) ; also sheet 5
SRAM_D11: U5.D2(D11) ; also sheet 5
SRAM_D12: U5.E2(D12) ; also sheet 5
SRAM_D13: U5.F2(D13) ; also sheet 5
SRAM_D14: U5.F1(D14) ; also sheet 5
SRAM_D15: U5.G1(D15) ; also sheet 5
SRAM_OE: U5.A2(!OE) ; also sheet 5
SRAM_WE: U5.G5(!WE) ; also sheet 5
VCC_30_14: C9.1 C64.2 C65.2 C66.2 C67.2 C68.2 C69.2 C70.2 C71.2 C72.2 C73.2 J5.1 R30.1 R37.1 R38.1 R39.1 R44.1 R63.1 R64.1 R70.2 U11.8(VCC) X1.1(EN) X1.4(VS+) X2.1(EN) X2.4(VS+) ; also sheet 2,3,5
VCC_30_34: C21.2 C22.2 C23.2 C56.2 C57.2 C58.2 C59.2 C60.2 C61.2 C62.2 C63.2 U5.D6(VCC) U5.E1(VCC) ; also sheet 1,3,5
Unconnected: U5.A6(NC) U5.E3(NC) U5.G2(NC) U5.H6(NC)

### Notes on the sheet
- Two pin header with rectangle.
- No Load | No Load

## Sheet 7 of 7
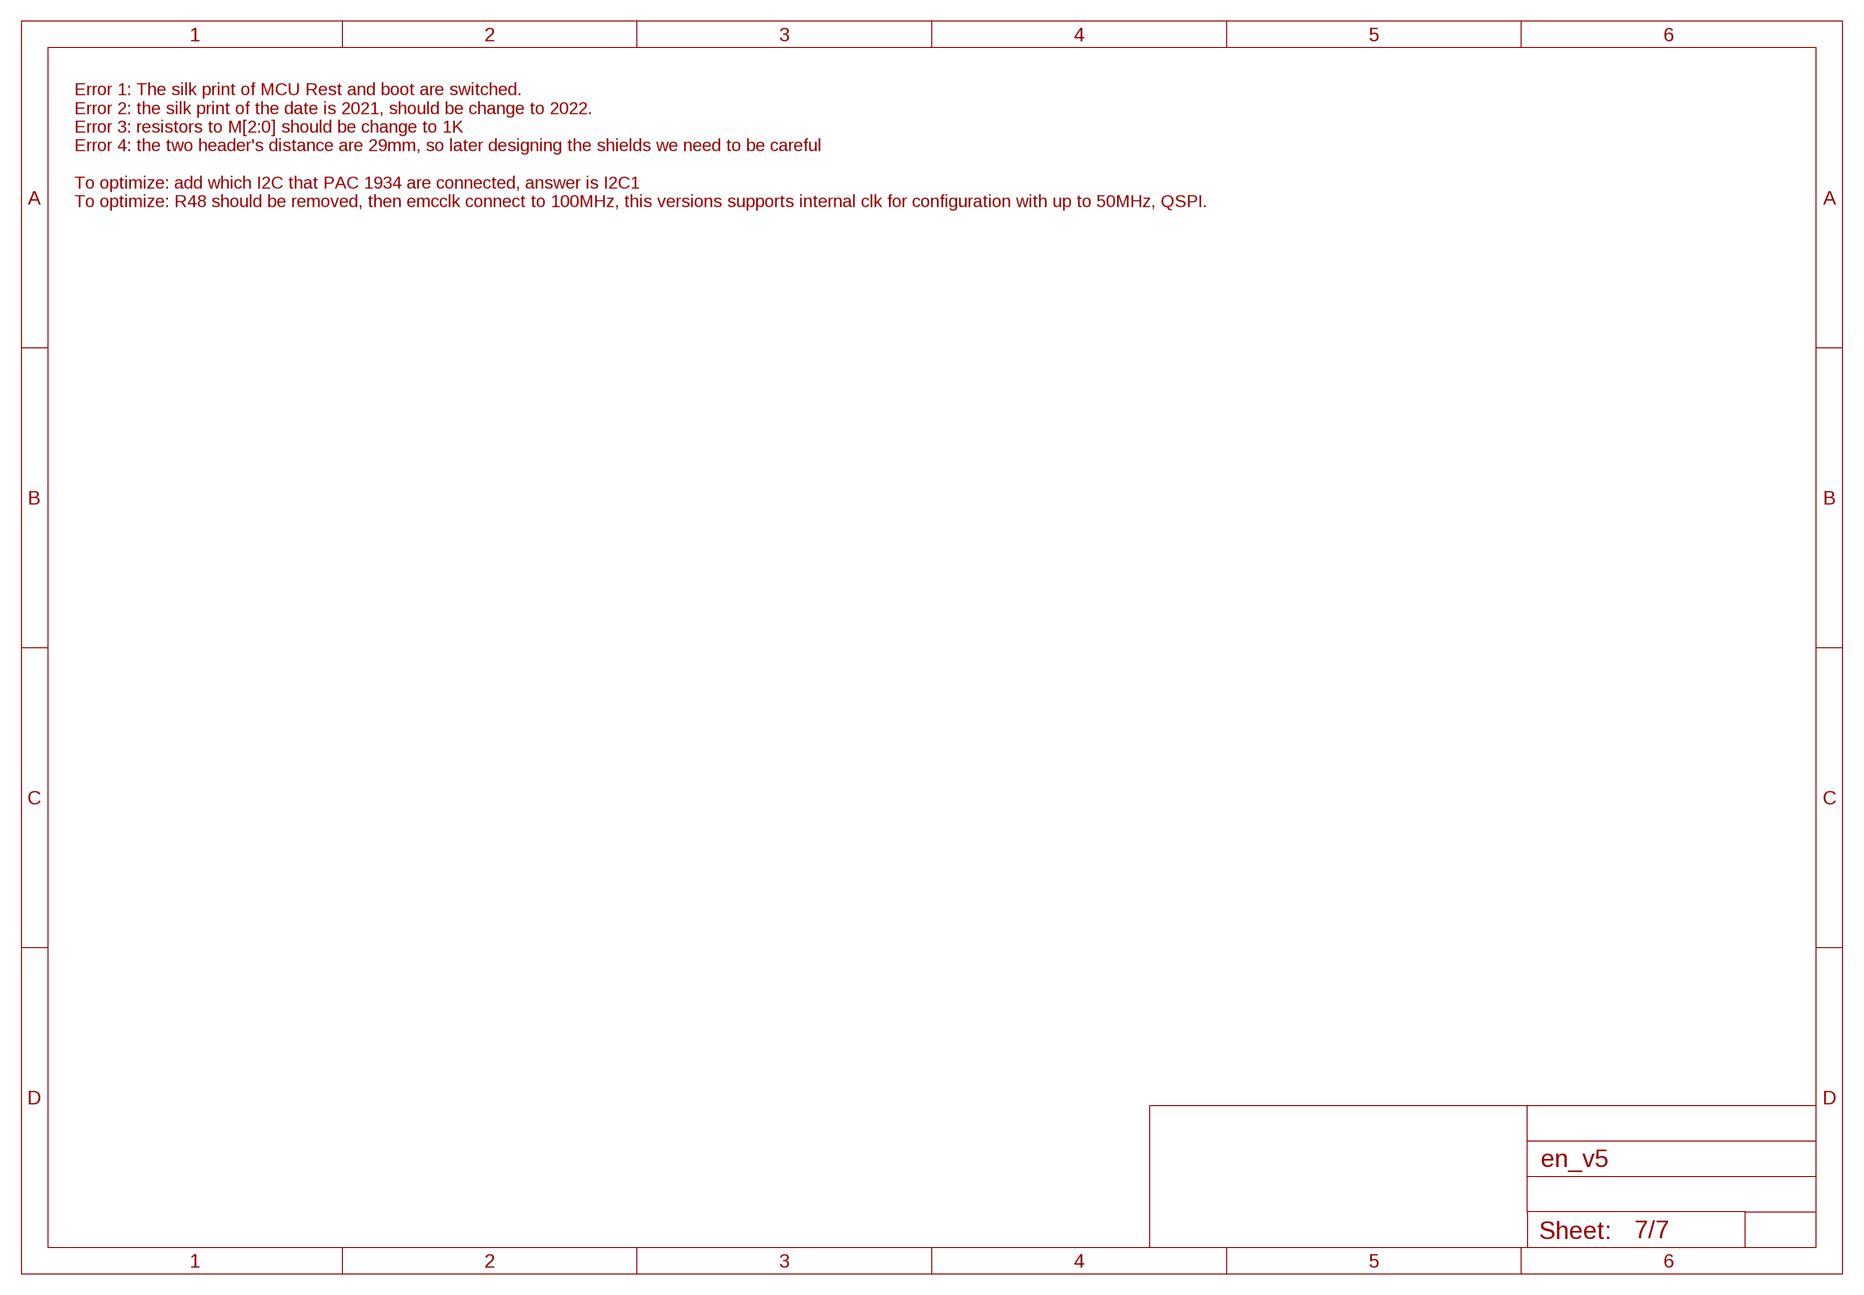
[diagram p6: schematic, sheet 7]

### Notes on the sheet
- Error 1: The silk print of MCU Rest and boot are switched.
  Error 2: the silk print of the date is 2021, should be change to 2022.
  Error 3: resistors to M[2:0] should be change to 1K
  Error 4: the two header's distance are 29mm, so later designing the shields we need to be careful
  
  To optimize: add which I2C that PAC 1934 are connected, answer is I2C1
  To optimize: R48 should be removed, then emcclk connect to 100MHz, this versions supports internal clk for configuration with up to 50MHz, QSPI.

## Library data of the parts
C1-C74 C88 = passive:CAPACITOR; OC_NEWARK: unknown
D1 = diodes:SCHOTTKY_DIODE; OC_NEWARK: unknown
D2-D10 = opto:LED; OC_NEWARK: unknown
J1 = connectors:USB4105-GF-A: USB-C (USB TYPE-C) USB 2.0 Receptacle Connector 24 (16+8 Dummy) Position Surface Mount, Right Angle; Through Hole Check availability <https://pricing.snapeda.com/parts/USB4105-GF-A/GCT/view-part?ref=eda>; AVAILABILITY: In Stock; DESCRIPTION: USB-C (USB TYPE-C) USB 2.0 Receptacle Connector 24 (16+8 Dummy) Position Surface Mount, Right Angle; Through Hole; MF: GCT; MP: USB4105-GF-A; PACKAGE: None; PRICE: None; PURCHASE-URL: https://pricing.snapeda.com/search/part/USB4105-GF-A/?ref=eda
J2 J3 = connectors:M50-3142045: Headers & Wire Housings 20 WAY SIL VERT SMT SKT Source: Datasheet <https://componentsearchengine.com/Datasheets/1/M50-3142045.pdf>; OC_NEWARK: unknown
J5 = connectors:FEMALE_HEADER_2X1; OC_NEWARK: unknown
L1-L3 = passive:INDUCTOR; OC_NEWARK: unknown
M3 M4 = power:SISS23DN; OC_NEWARK: unknown
P1 = connectors:JST-S2B-PH-SM4-TB: CONN HEADER PH SIDE 2POS 2MM SMD Check prices <https://pricing.snapeda.com/parts/S2B-PH-SM4-TB/JST%20Sales/view-part?ref=eda>; AVAILABILITY: Bad; DESCRIPTION: Connector Header Surface Mount, Right Angle 2 position 0.079 (2.00mm); MP: S2B-PH-SM4-TB; OC_NEWARK: unknown; PACKAGE: None; PRICE: None
Q1 Q2 = transistor:FDN302P: P-Channel MOSFET 2.5V Specified PowerTrench Check prices <https://pricing.snapeda.com/parts/FDN302P/ON%20Semiconductor/view-part?ref=eda>; OC_NEWARK: unknown
R1-R47 R49-R71 = passive:RESISTOR; OC_NEWARK: unknown
S1-S3 = connectors:TACTILE-SWITCH: 612-TL3365AF180QG; OC_NEWARK: unknown
TP1 = connectors:TEST_POINT
U1 = power:MCP73833T-AMI/MF: Linear Charge Management Controller Li-Ion/Li-Pol 1mA 4.2V/4.35V/4.4V/4.5V 10-Pin DFN EP T/R Check prices <https://pricing.snapeda.com/parts/MCP73833T-AMI/MF/Microchip%20Technology/view-part?ref=eda>; OC_NEWARK: unknown
U4 = device:RP2040; OC_NEWARK: unknown
U5 = ic:CY7C1051DV33: SRAM 8Mb 10ns3.3V 512Kx16 Fast Async; OC_NEWARK: unknown
U6 = fpga:SPARTAN7-LX15
U7 = ic:W25Q16JVUXIQ: W25Q16JV - NOR Flash Technical Specifications: VCC: 2.7-3.6V Operating Temperature: -40°C to 85°C Mouser: 454-W25Q16JVUXIQTR
U8 U9 = sensors:PAC1934: Current & Power Monitors & Regulators Quad High-Side Current Sensor, I2C/SMBus, 32V with Accumulator; OC_NEWARK: unknown
U10 = power:REF3012AIDBZR: CMOS VOLTAGE REFERENCE Check prices <https://pricing.snapeda.com/parts/REF3012AIDBZR/Texas%20Instruments/view-part?ref=eda>; AVAILABILITY: Good; DESCRIPTION: 1.25-V, 50-ppm/C, 50-A in 3-pin SOT-23 package series (bandgap) voltage reference 3-SOT-23 -40 to 125; MP: REF3012AIDBZR; OC_NEWARK: unknown; PACKAGE: SOT-23-3 Texas Instruments; PRICE: None; PURCHASE-URL: https://pricing.snapeda.com/search/part/REF3012AIDBZR/?ref=eda
U11 = ic:S25FL256S: FLASH - NOR Memory IC 256Mb (32M x 8) SPI - Quad I/O WSON-8 (6x8) Source: Datasheet <https://www.cypress.com/file/448601/download> Check prices <https://www.mouser.de/ProductDetail/Cypress-Spansion/S25FL256SAGNFI001?qs=rDGpJoRV1kKsEn98ei3h6w%3D%3D>
U12 = power:LTC3569EUDPBF: Triple Buck Regulator with 1.2A and Two 600mA Outputs and Individual Programmable References Check availability <https://pricing.snapeda.com/parts/LTC3569EUD%23PBF/Analog%20Devices/view-part?ref=eda>; AVAILABILITY: In Stock; DESCRIPTION: Buck Switching Regulator IC Positive Adjustable 0.425V 3 Output 600mA, 1.2A 20-WFQFN Exposed Pad; MF: Analog Devices; MP: LTC3569EUD#PBF; PACKAGE: QFN -20 Analog Devices; PRICE: None; PURCHASE-URL: https://pricing.snapeda.com/search/part/LTC3569EUD#PBF/?ref=eda
X1 X2 = passive:OSCILLATOR; OC_NEWARK: unknown
X3 = passive:QUARTZ

## Net classes
1 diff pairs: width 0.102 mm